# Altium schematic sheet Reference Source 3.3V.SchDoc: Reference Voltage 3.3V
size Letter
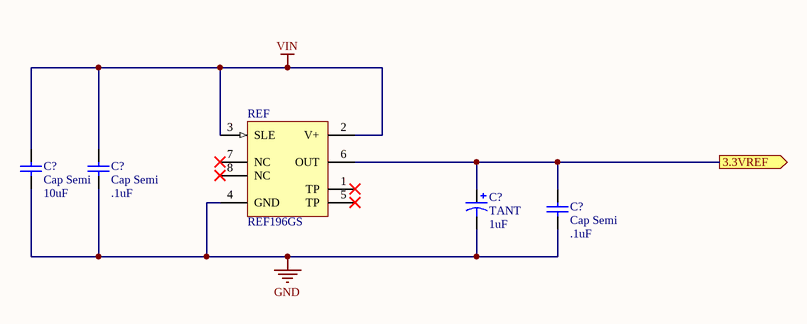
[diagram p0: Reference Source 3.3V.SchDoc]

## Parts
(Parts that share a designator on the sheet are numbered #1, #2 ... from top to bottom, then left to right.)
C?#1  Cap Semi  value 10uF  [C1206]
C?#2  Cap Semi  value .1uF  [C1206]
C?#3  TANT  value 1uF  [TC3216-1206]
C?#4  Cap Semi  value .1uF  [C1206]
REF  REF196GS  [SO-8_N]

## Ports
3.3VREF (out)

## Nets
GND: C?#1.1 C?#2.1 C?#3.2 C?#4.1 REF.4(GND)
VIN: C?#1.2 C?#2.2 REF.2(V+) REF.3(SLE)
3.3VREF: C?#3.1 C?#4.2 REF.6(OUT) ; port 3.3VREF

Not connected (* = marked no-connect by the designer): REF 1(TP)* 5(TP)* 7(NC)* 8(NC)*

## Notes on the sheet
- Title
- Size:
- Date:
- Letter
- Number:
- Time:
- Revision:
- Sheet
- of
- File:

## Library data of the parts
C?#1 C?#2 C?#4 = Cap Semi: Capacitor (Semiconductor SIM Model); Published: 8-Jun-2000; LatestRevisionDate: 29-May-2009; LatestRevisionNote: IPC-7351 Footprint Added.; PackageReference: C1206; Publisher: Altium Limited; PackageDescription: Chip Capacitor
C?#3 = Cap Pol3: Polarized Capacitor (Surface Mount); Published: 8-Jun-2000; LatestRevisionDate: 29-May-2009; LatestRevisionNote: IPC-7351 Footprint Added.; PackageReference: C0805; Publisher: Altium Limited; PackageDescription: Chip Capacitor; DIGIKEY: 478-3857-1-ND
REF = REF196GS: 3.30V, Precision Micropower, Low-Dropout, Voltage Reference; Note: Pins 7 and 8 are not connected; Pins 1 and 5 are factory test only, make no electrical connection; Published: 8-Jun-2000; LatestRevisionDate: 13-Apr-2006; LatestRevisionNote: IPC-7351 Footprint Added.; DatasheetVersion: REV. C; PackageVersion: revA; PackageReference: SO-8; Publisher: Altium Limited; PackageDescription: 8-Pin Small Outline Integrated Circuit 1.27 mm Pitch; Code_JEDEC: MS-012-AA; Code_IPC: SOIC127P600-8; ComponentLink1Description: Manufacturer Link; ComponentLink1URL: http://www.analog.com/en/prod/0,,769_838_REF191%2C00.html; ComponentLink2Description: Datasheet; ComponentLink2URL: http://www.analog.com/UploadedFiles/Data_Sheets/564838270REF19x_h.pdf